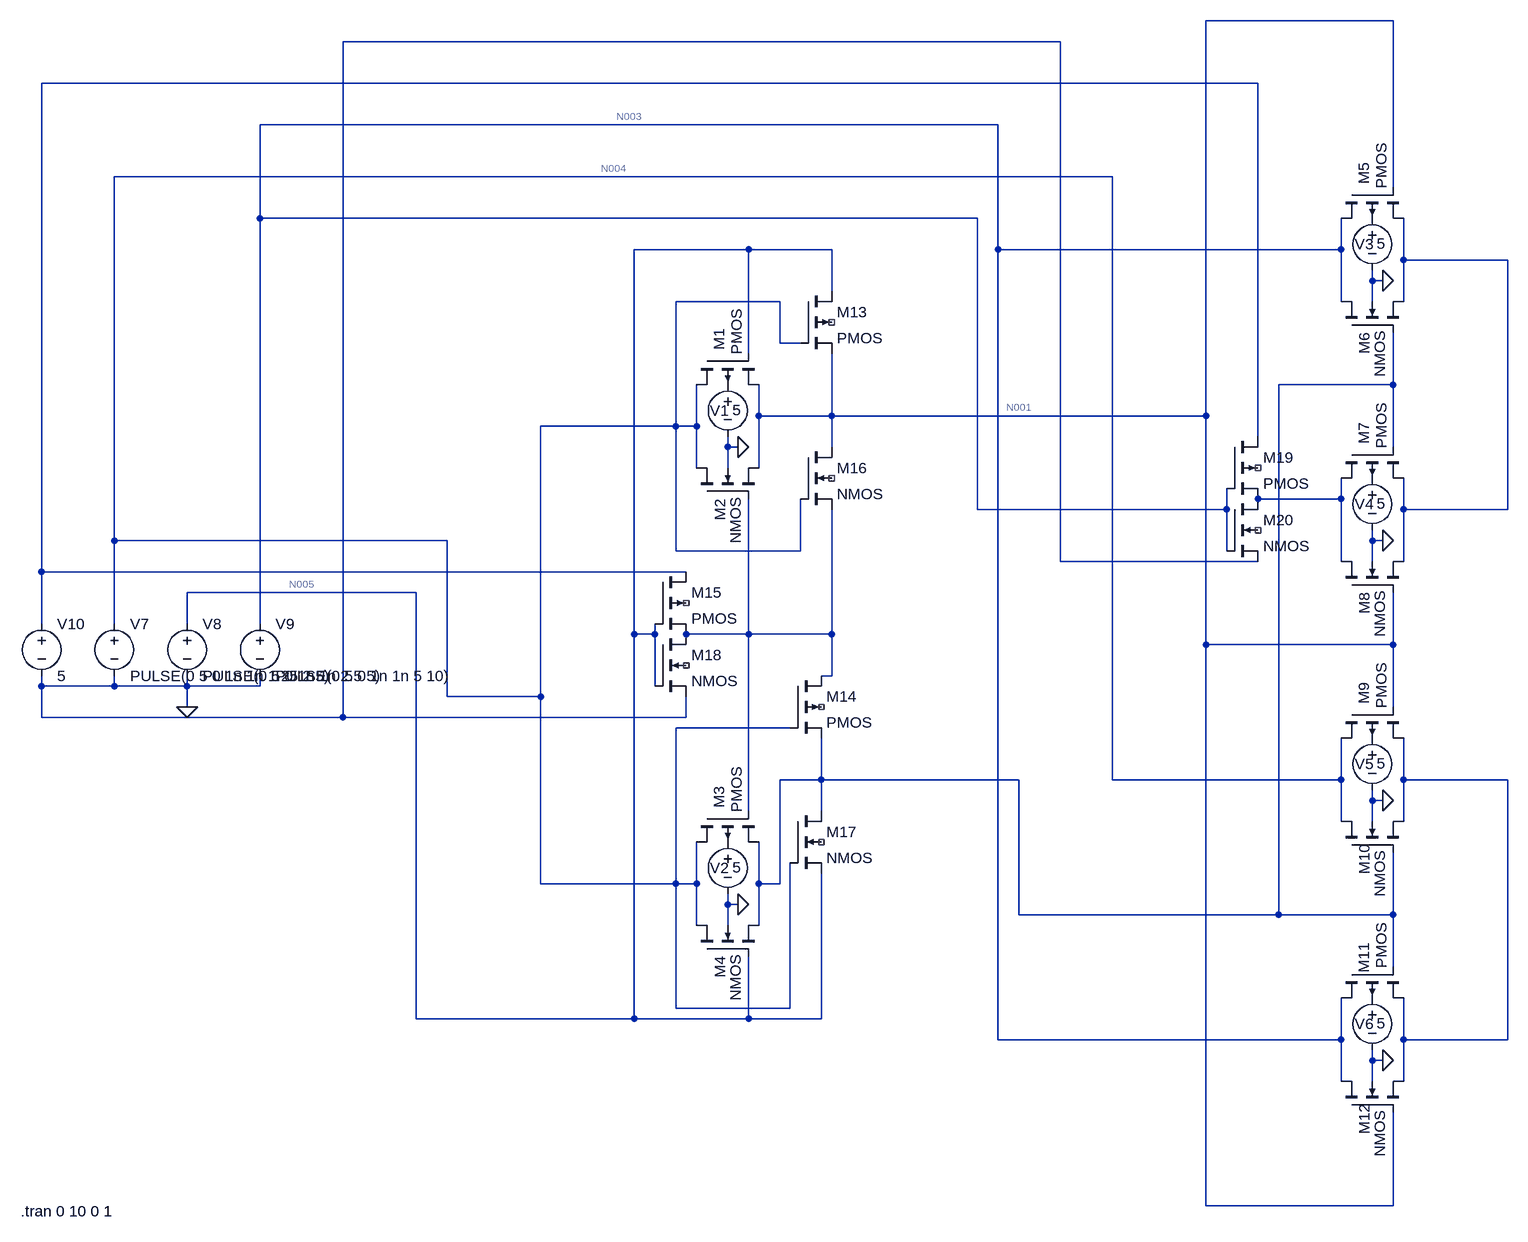
[diagram p0: schematic tg_fa.asc]
tg_fa.asc, the LTspice schematic file:
Version 4
SHEET 1 1316 936
WIRE 1136 -912 848 -912
WIRE 624 -880 -480 -880
WIRE 928 -816 -944 -816
WIRE 528 -752 -608 -752
WIRE 704 -672 -832 -672
WIRE 1136 -656 1136 -912
WIRE -608 -608 -608 -752
WIRE 496 -608 -608 -608
WIRE 144 -560 -32 -560
WIRE 272 -560 144 -560
WIRE 528 -560 528 -752
WIRE 1056 -560 1056 -608
WIRE 1056 -560 528 -560
WIRE 1152 -544 1152 -608
WIRE 1312 -544 1152 -544
WIRE 1104 -512 1104 -528
WIRE 1120 -512 1104 -512
WIRE 272 -496 272 -560
WIRE 192 -480 32 -480
WIRE 1056 -480 1056 -560
WIRE 1104 -480 1104 -512
WIRE 1152 -480 1152 -544
WIRE 192 -416 192 -480
WIRE 224 -416 192 -416
WIRE 144 -400 144 -560
WIRE 1136 -352 1136 -432
WIRE 1136 -352 960 -352
WIRE 160 -304 160 -352
WIRE 272 -304 272 -400
WIRE 272 -304 160 -304
WIRE 848 -304 848 -912
WIRE 848 -304 272 -304
WIRE 32 -288 32 -480
WIRE 32 -288 -176 -288
WIRE 64 -288 64 -352
WIRE 64 -288 32 -288
WIRE 928 -272 928 -816
WIRE 112 -256 112 -272
WIRE 128 -256 112 -256
WIRE 272 -256 272 -304
WIRE 1136 -256 1136 -352
WIRE 64 -224 64 -288
WIRE 112 -224 112 -256
WIRE 160 -224 160 -304
WIRE 1056 -176 1056 -208
WIRE 1056 -176 928 -176
WIRE 496 -160 496 -608
WIRE 880 -160 880 -192
WIRE 880 -160 496 -160
WIRE 1152 -160 1152 -208
WIRE 1312 -160 1312 -544
WIRE 1312 -160 1152 -160
WIRE -832 -112 -832 -672
WIRE -320 -112 -832 -112
WIRE 1104 -112 1104 -128
WIRE 1120 -112 1104 -112
WIRE 32 -96 32 -288
WIRE 224 -96 224 -176
WIRE 224 -96 32 -96
WIRE 880 -96 880 -160
WIRE 624 -80 624 -880
WIRE 928 -80 624 -80
WIRE 1056 -80 1056 -176
WIRE 1104 -80 1104 -112
WIRE 1152 -80 1152 -160
WIRE -944 -64 -944 -816
WIRE 48 -64 -944 -64
WIRE -368 -32 -720 -32
WIRE -944 16 -944 -64
WIRE -832 16 -832 -112
WIRE -720 16 -720 -32
WIRE -608 16 -608 -608
WIRE -32 32 -32 -560
WIRE 0 32 0 16
WIRE 0 32 -32 32
WIRE 144 32 144 -176
WIRE 144 32 48 32
WIRE 272 32 272 -160
WIRE 272 32 144 32
WIRE 848 48 848 -304
WIRE 1136 48 1136 -32
WIRE 1136 48 848 48
WIRE 272 96 272 32
WIRE 272 96 256 96
WIRE -944 112 -944 96
WIRE -832 112 -832 96
WIRE -832 112 -944 112
WIRE -720 112 -720 96
WIRE -720 112 -832 112
WIRE -608 112 -608 96
WIRE -608 112 -720 112
WIRE 0 112 0 32
WIRE -320 128 -320 -112
WIRE -176 128 -176 -288
WIRE -176 128 -320 128
WIRE -720 144 -720 112
WIRE 1136 144 1136 48
WIRE -944 160 -944 112
WIRE -480 160 -480 -880
WIRE -480 160 -944 160
WIRE 48 160 48 128
WIRE 48 160 -480 160
WIRE 208 176 32 176
WIRE 256 256 256 192
WIRE 256 256 192 256
WIRE 560 256 256 256
WIRE 704 256 704 -672
WIRE 1056 256 1056 192
WIRE 1056 256 704 256
WIRE 1152 256 1152 192
WIRE 1312 256 1152 256
WIRE 1104 288 1104 272
WIRE 1120 288 1104 288
WIRE 144 304 144 32
WIRE 256 304 256 256
WIRE 1056 320 1056 256
WIRE 1104 320 1104 288
WIRE 1152 320 1152 256
WIRE -176 416 -176 128
WIRE 32 416 32 176
WIRE 32 416 -176 416
WIRE 64 416 64 352
WIRE 64 416 32 416
WIRE 160 416 160 352
WIRE 192 416 192 256
WIRE 192 416 160 416
WIRE 112 448 112 432
WIRE 128 448 112 448
WIRE 560 464 560 256
WIRE 960 464 960 -352
WIRE 960 464 560 464
WIRE 1136 464 1136 368
WIRE 1136 464 960 464
WIRE 64 480 64 416
WIRE 112 480 112 448
WIRE 160 480 160 416
WIRE 1136 544 1136 464
WIRE 32 608 32 416
WIRE 208 608 208 384
WIRE 208 608 32 608
WIRE -368 624 -368 -32
WIRE -32 624 -32 32
WIRE -32 624 -368 624
WIRE 144 624 144 528
WIRE 144 624 -32 624
WIRE 256 624 256 400
WIRE 256 624 144 624
WIRE 528 656 528 -560
WIRE 1056 656 1056 592
WIRE 1056 656 528 656
WIRE 1152 656 1152 592
WIRE 1312 656 1312 256
WIRE 1312 656 1152 656
WIRE 1104 688 1104 672
WIRE 1120 688 1104 688
WIRE 1056 720 1056 656
WIRE 1104 720 1104 688
WIRE 1152 720 1152 656
WIRE 848 912 848 48
WIRE 1136 912 1136 768
WIRE 1136 912 848 912
FLAG 128 -256 0
FLAG 128 448 0
FLAG 1120 -512 0
FLAG 1120 -112 0
FLAG 1120 288 0
FLAG 1120 688 0
FLAG -720 144 0
SYMBOL pmos4 64 -400 M90
WINDOW 0 -38 35 Left 2
WINDOW 3 -68 62 Left 2
SYMATTR InstName M1
SYMBOL nmos4 64 -176 R270
WINDOW 0 -34 36 Left 2
WINDOW 3 -69 60 Left 2
SYMATTR InstName M2
SYMBOL voltage 112 -368 R0
WINDOW 0 -27 56 Left 2
WINDOW 3 7 55 Left 2
WINDOW 123 0 0 Left 0
WINDOW 39 0 0 Left 0
SYMATTR InstName V1
SYMATTR Value 5
SYMBOL pmos4 64 304 M90
WINDOW 0 -38 35 Left 2
WINDOW 3 -68 62 Left 2
SYMATTR InstName M3
SYMBOL nmos4 64 528 R270
WINDOW 0 -34 36 Left 2
WINDOW 3 -69 60 Left 2
SYMATTR InstName M4
SYMBOL voltage 112 336 R0
WINDOW 0 -27 56 Left 2
WINDOW 3 7 55 Left 2
WINDOW 123 0 0 Left 0
WINDOW 39 0 0 Left 0
SYMATTR InstName V2
SYMATTR Value 5
SYMBOL pmos4 1056 -656 M90
WINDOW 0 -38 35 Left 2
WINDOW 3 -68 62 Left 2
SYMATTR InstName M5
SYMBOL nmos4 1056 -432 R270
WINDOW 0 -34 36 Left 2
WINDOW 3 -69 60 Left 2
SYMATTR InstName M6
SYMBOL voltage 1104 -624 R0
WINDOW 0 -27 56 Left 2
WINDOW 3 7 55 Left 2
WINDOW 123 0 0 Left 0
WINDOW 39 0 0 Left 0
SYMATTR InstName V3
SYMATTR Value 5
SYMBOL pmos4 1056 -256 M90
WINDOW 0 -38 35 Left 2
WINDOW 3 -68 62 Left 2
SYMATTR InstName M7
SYMBOL nmos4 1056 -32 R270
WINDOW 0 -34 36 Left 2
WINDOW 3 -69 60 Left 2
SYMATTR InstName M8
SYMBOL voltage 1104 -224 R0
WINDOW 0 -27 56 Left 2
WINDOW 3 7 55 Left 2
WINDOW 123 0 0 Left 0
WINDOW 39 0 0 Left 0
SYMATTR InstName V4
SYMATTR Value 5
SYMBOL pmos4 1056 144 M90
WINDOW 0 -38 35 Left 2
WINDOW 3 -68 62 Left 2
SYMATTR InstName M9
SYMBOL nmos4 1056 368 R270
WINDOW 0 -34 36 Left 2
WINDOW 3 -69 60 Left 2
SYMATTR InstName M10
SYMBOL voltage 1104 176 R0
WINDOW 0 -27 56 Left 2
WINDOW 3 7 55 Left 2
WINDOW 123 0 0 Left 0
WINDOW 39 0 0 Left 0
SYMATTR InstName V5
SYMATTR Value 5
SYMBOL pmos4 1056 544 M90
WINDOW 0 -38 35 Left 2
WINDOW 3 -68 62 Left 2
SYMATTR InstName M11
SYMBOL nmos4 1056 768 R270
WINDOW 0 -34 36 Left 2
WINDOW 3 -69 60 Left 2
SYMATTR InstName M12
SYMBOL voltage 1104 576 R0
WINDOW 0 -27 56 Left 2
WINDOW 3 7 55 Left 2
WINDOW 123 0 0 Left 0
WINDOW 39 0 0 Left 0
SYMATTR InstName V6
SYMATTR Value 5
SYMBOL pmos4 224 -496 R0
SYMATTR InstName M13
SYMBOL pmos4 208 96 R0
SYMATTR InstName M14
SYMBOL pmos4 0 -64 R0
SYMATTR InstName M15
SYMBOL nmos4 224 -256 R0
SYMATTR InstName M16
SYMBOL nmos4 208 304 R0
SYMATTR InstName M17
SYMBOL nmos4 0 32 R0
SYMATTR InstName M18
SYMBOL voltage -832 0 R0
WINDOW 123 0 0 Left 0
WINDOW 39 0 0 Left 0
SYMATTR InstName V7
SYMATTR Value PULSE(0 5 0 1n 1n 1.25 2.5)
SYMBOL voltage -720 0 R0
WINDOW 123 0 0 Left 0
WINDOW 39 0 0 Left 0
SYMATTR InstName V8
SYMATTR Value PULSE(0 5 0 1n 1n 2.5 5)
SYMBOL voltage -608 0 R0
WINDOW 123 0 0 Left 0
WINDOW 39 0 0 Left 0
SYMATTR InstName V9
SYMATTR Value PULSE(0 5 0 1n 1n 5 10)
SYMBOL voltage -944 0 R0
WINDOW 123 0 0 Left 0
WINDOW 39 0 0 Left 0
SYMATTR InstName V10
SYMATTR Value 5
SYMBOL pmos4 880 -272 R0
SYMATTR InstName M19
SYMBOL nmos4 880 -176 R0
SYMATTR InstName M20
TEXT -976 920 Left 2 !.tran 0 10 0 1

The netlist it stands for:
* tg_fa.asc
M1 N004 N005 N001 P001 PMOS
M2 N004 N009 N001 0 NMOS
V1 P001 0 5
M3 N004 N009 N007 P002 PMOS
M4 N004 N005 N007 0 NMOS
V2 P002 0 5
M5 N003 N001 N006 P003 PMOS
M6 N003 N007 N006 0 NMOS
V3 P003 0 5
M7 N008 N007 N006 P004 PMOS
M8 N008 N001 N006 0 NMOS
V4 P004 0 5
M9 N004 N001 N010 P005 PMOS
M10 N004 N007 N010 0 NMOS
V5 P005 0 5
M11 N003 N007 N010 P006 PMOS
M12 N003 N001 N010 0 NMOS
V6 P006 0 5
M13 N005 N004 N001 NC_01 PMOS
M14 N009 N004 N007 NC_02 PMOS
M15 N002 N005 N009 NC_03 PMOS
M16 N001 N004 N009 NC_04 NMOS
M17 N007 N004 N005 NC_05 NMOS
M18 N009 N005 0 NC_06 NMOS
V7 N004 0 PULSE(0 5 0 1n 1n 1.25 2.5)
V8 N005 0 PULSE(0 5 0 1n 1n 2.5 5)
V9 N003 0 PULSE(0 5 0 1n 1n 5 10)
V10 N002 0 5
M19 N002 N003 N008 NC_07 PMOS
M20 N008 N003 0 NC_08 NMOS
.model NMOS NMOS
.model PMOS PMOS
.lib standard.mos
.tran 0 10 0 1
.backanno
.end

* Results of the author's LTspice run, read from the files saved beside the schematic
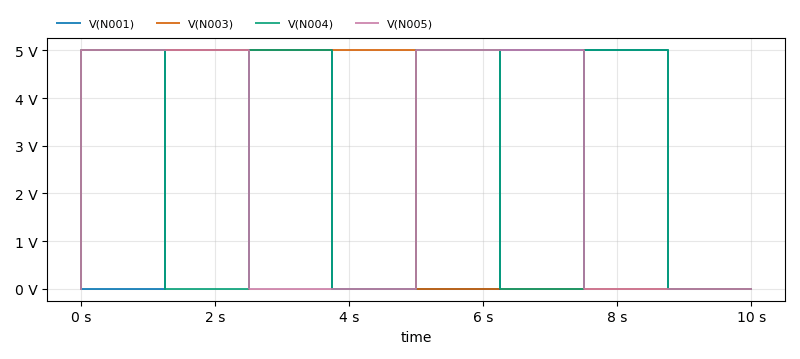
[diagram p1: Transient Analysis of tg_fa.asc, plotted from the saved traces]
* Transient Analysis, 1 run:
*   V(N001): min 0 V, max 5 V, average 2.5 V, rms 3.536 V, last 0 V
*   V(N003): min 0 V, max 5 V, average 2.5 V, rms 3.536 V, last 0 V
*   V(N004): min 0 V, max 5 V, average 2.5 V, rms 3.536 V, last 0 V
*   V(N005): min 0 V, max 5 V, average 2.5 V, rms 3.536 V, last 0 V